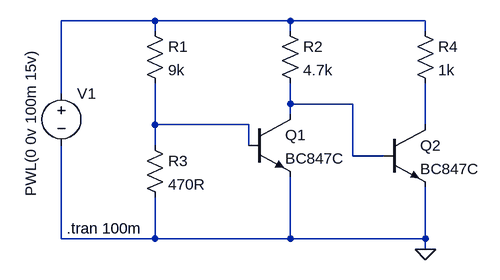
[diagram p0: schematic NPNCircuit.asc]
NPNCircuit.asc, the LTspice schematic file:
Version 4
SHEET 1 880 680
WIRE 112 16 -32 16
WIRE 320 16 112 16
WIRE 528 16 320 16
WIRE 112 32 112 16
WIRE 320 32 320 16
WIRE 528 32 528 16
WIRE -32 128 -32 16
WIRE 320 144 320 112
WIRE 416 144 320 144
WIRE 320 160 320 144
WIRE 112 176 112 112
WIRE 256 176 112 176
WIRE 528 176 528 112
WIRE 112 208 112 176
WIRE 256 208 256 176
WIRE 416 224 416 144
WIRE 464 224 416 224
WIRE -32 352 -32 208
WIRE 112 352 112 288
WIRE 112 352 -32 352
WIRE 320 352 320 256
WIRE 320 352 112 352
WIRE 528 352 528 272
WIRE 528 352 320 352
WIRE 528 368 528 352
FLAG 528 368 0
SYMBOL voltage -32 112 R0
WINDOW 3 -47 175 VLeft 2
WINDOW 123 0 0 Left 0
WINDOW 39 0 0 Left 0
SYMATTR InstName V1
SYMATTR Value PWL(0 0v 100m 15v)
SYMBOL res 96 16 R0
SYMATTR InstName R1
SYMATTR Value 9k
SYMBOL res 304 16 R0
SYMATTR InstName R2
SYMATTR Value 4.7k
SYMBOL res 96 192 R0
SYMATTR InstName R3
SYMATTR Value 470R
SYMBOL res 512 16 R0
SYMATTR InstName R4
SYMATTR Value 1k
SYMBOL npn 256 160 R0
SYMATTR InstName Q1
SYMATTR Value BC847C
SYMBOL npn 464 176 R0
SYMATTR InstName Q2
SYMATTR Value BC847C
TEXT -24 336 Left 2 !.tran 100m

The netlist it stands for:
* NPNCircuit.asc
V1 N001 0 PWL(0 0v 100m 15v)
R1 N001 N003 9k
R2 N001 N002 4.7k
R3 N003 0 470R
R4 N001 N004 1k
Q1 N002 N003 0 0 BC847C
Q2 N004 N002 0 0 BC847C
.model NPN NPN
.model PNP PNP
.lib standard.bjt
.tran 100m
.backanno
.end